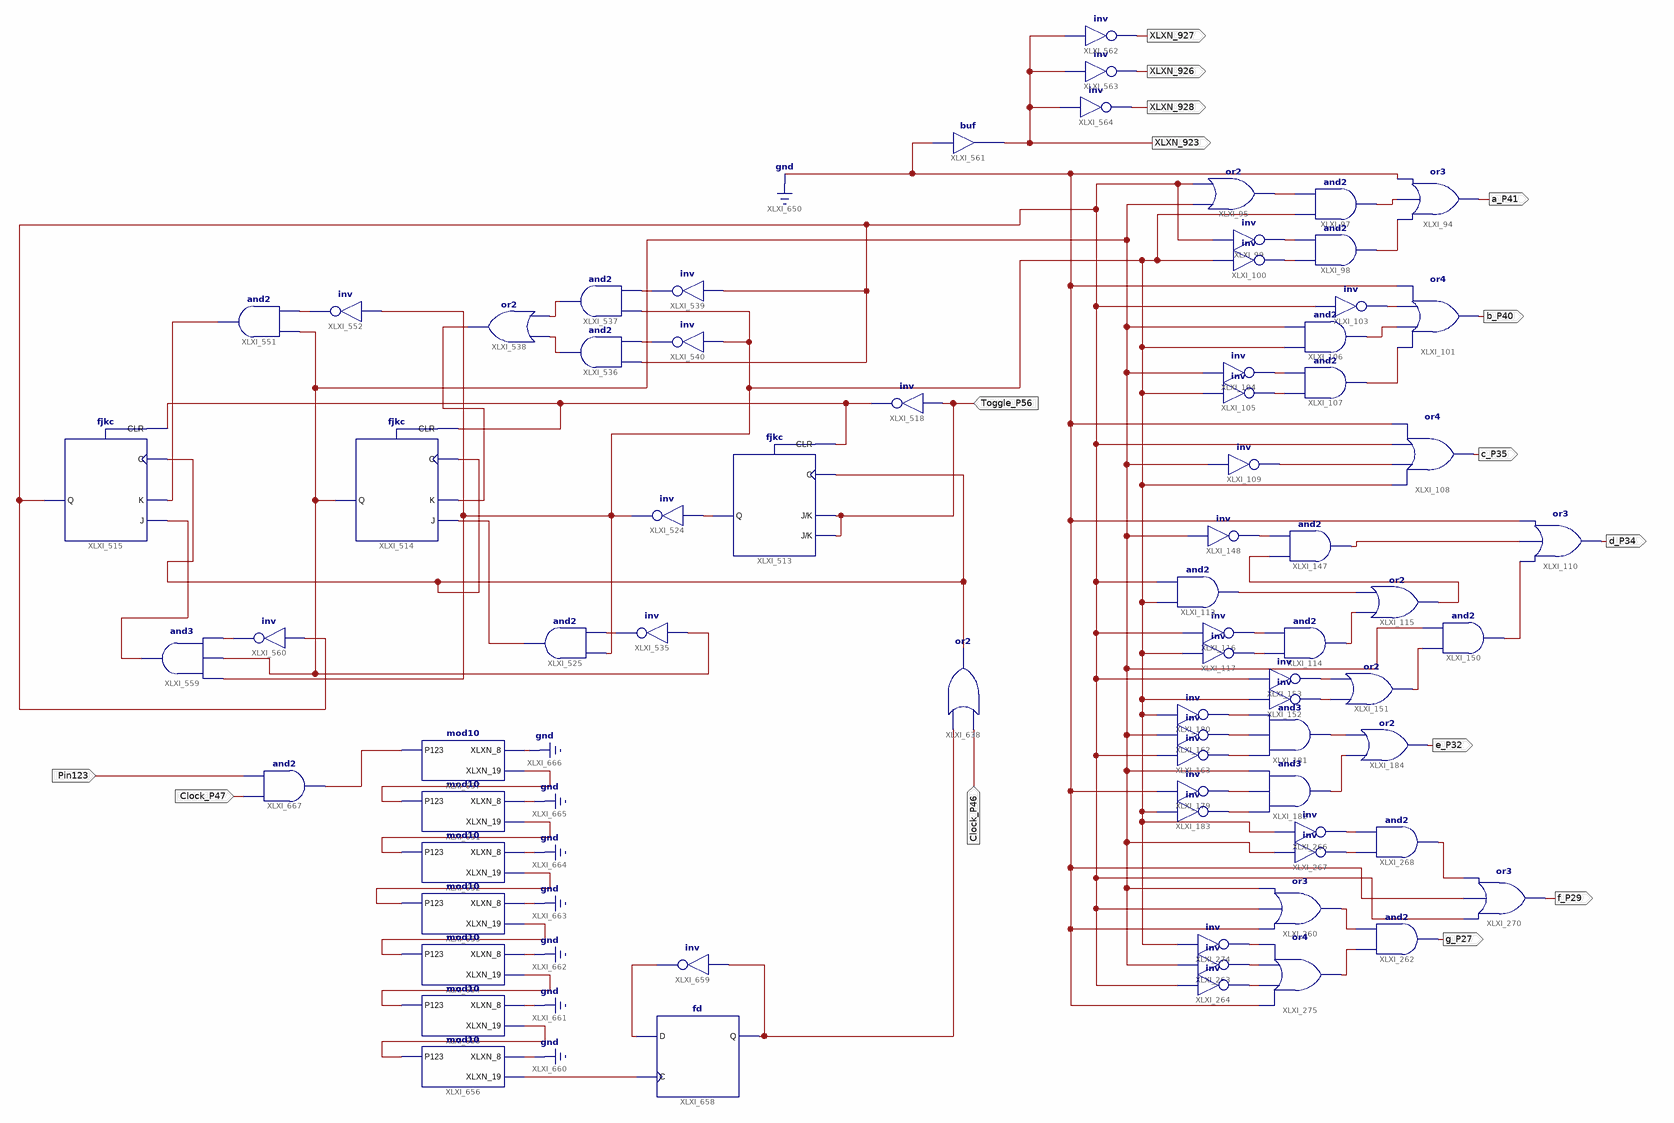
[diagram p0: schematic sheet 1]
// Xilinx ISE schematic Lab05_no2.sch (spartan6) as structural Verilog: 75 symbols, 15 ports
module Lab05_no2 (
  input  Toggle_P56,
  input  Clock_P46,
  input  Clock_P47,
  input  Pin123,
  output a_P41,
  output b_P40,
  output c_P35,
  output e_P32,
  output d_P34,
  output g_P27,
  output f_P29,
  output XLXN_923,
  output XLXN_926,
  output XLXN_927,
  output XLXN_928
);

  wire A_P58, B_P57, C_P56, XLXN_234, XLXN_238, XLXN_241, XLXN_242, XLXN_243, XLXN_249, XLXN_250, XLXN_251,
       XLXN_253, XLXN_254, XLXN_263, XLXN_277, XLXN_278, XLXN_279, XLXN_293, XLXN_320, XLXN_322, XLXN_323,
       XLXN_328, XLXN_329, XLXN_330, XLXN_333, XLXN_380, XLXN_381, XLXN_382, XLXN_383, XLXN_384, XLXN_386,
       XLXN_387, XLXN_513, XLXN_514, XLXN_519, XLXN_520, XLXN_532, XLXN_533, XLXN_536, XLXN_545, XLXN_879,
       XLXN_888, XLXN_891, XLXN_892, XLXN_893, XLXN_895, XLXN_896, XLXN_907, XLXN_910, XLXN_912, XLXN_920,
       XLXN_921, XLXN_1032, XLXN_1034, XLXN_1035, XLXN_1036, XLXN_1038, XLXN_1039, XLXN_1040, XLXN_1041,
       XLXN_1042, XLXN_1060, XLXN_1061, XLXN_1063;

  or XLXI_94 (a_P41, XLXN_241, XLXN_234, 1'b0);
  or XLXI_95 (XLXN_238, B_P57, C_P56);
  and XLXI_97 (XLXN_234, A_P58, XLXN_238);
  and XLXI_98 (XLXN_241, XLXN_243, XLXN_242);
  not XLXI_99 (XLXN_242, C_P56);
  not XLXI_100 (XLXN_243, A_P58);
  or XLXI_101 (b_P40, XLXN_251, XLXN_250, XLXN_249, 1'b0);
  not XLXI_103 (XLXN_249, C_P56);
  and XLXI_106 (XLXN_250, A_P58, B_P57);
  and XLXI_107 (XLXN_251, XLXN_253, XLXN_254);
  not XLXI_105 (XLXN_253, A_P58);
  not XLXI_104 (XLXN_254, B_P57);
  not XLXI_109 (XLXN_263, B_P57);
  or XLXI_108 (c_P35, A_P58, XLXN_263, C_P56, 1'b0);
  or XLXI_115 (XLXN_322, XLXN_293, XLXN_277);
  not XLXI_116 (XLXN_278, C_P56);
  and XLXI_114 (XLXN_293, XLXN_279, XLXN_278);
  and XLXI_113 (XLXN_277, A_P58, C_P56);
  and XLXI_147 (XLXN_323, XLXN_322, XLXN_320);
  not XLXI_148 (XLXN_320, B_P57);
  or XLXI_110 (d_P34, XLXN_333, XLXN_323, 1'b0);
  and XLXI_150 (XLXN_333, XLXN_330, B_P57);
  or XLXI_151 (XLXN_330, XLXN_328, XLXN_329);
  not XLXI_117 (XLXN_279, A_P58);
  not XLXI_153 (XLXN_329, C_P56);
  not XLXI_152 (XLXN_328, A_P58);
  not XLXI_180 (XLXN_382, A_P58);
  not XLXI_162 (XLXN_381, B_P57);
  not XLXI_163 (XLXN_380, C_P56);
  and XLXI_181 (XLXN_386, XLXN_380, XLXN_381, XLXN_382);
  or XLXI_184 (e_P32, XLXN_387, XLXN_386);
  not XLXI_183 (XLXN_384, A_P58);
  not XLXI_179 (XLXN_383, 1'b0);
  or XLXI_260 (XLXN_513, 1'b0, C_P56, B_P57);
  and XLXI_262 (g_P27, XLXN_514, XLXN_513);
  not XLXI_263 (XLXN_519, B_P57);
  not XLXI_264 (XLXN_520, C_P56);
  and XLXI_268 (XLXN_536, XLXN_532, XLXN_533);
  and XLXI_182 (XLXN_387, XLXN_384, XLXN_383, B_P57);
  not XLXI_267 (XLXN_532, B_P57);
  not XLXI_266 (XLXN_533, A_P58);
  or XLXI_270 (f_P29, C_P56, 1'b0, XLXN_536);
  not XLXI_274 (XLXN_545, A_P58);
  or XLXI_275 (XLXN_514, 1'b0, XLXN_520, XLXN_519, XLXN_545);
  not XLXI_518 (XLXN_1032, Toggle_P56);
  fjkc XLXI_513 (.C(XLXN_1060), .CLR(XLXN_1032), .J(Toggle_P56), .K(Toggle_P56), .Q(XLXN_879));
  not XLXI_524 (A_P58, XLXN_879);
  and XLXI_525 (XLXN_891, XLXN_888, A_P58);
  fjkc XLXI_514 (.C(XLXN_1060), .CLR(XLXN_1032), .J(XLXN_891), .K(XLXN_907), .Q(B_P57));
  fjkc XLXI_515 (.C(XLXN_1060), .CLR(XLXN_1032), .J(XLXN_920), .K(XLXN_912), .Q(C_P56));
  not XLXI_535 (XLXN_888, B_P57);
  or XLXI_538 (XLXN_907, XLXN_893, XLXN_892);
  and XLXI_536 (XLXN_892, XLXN_896, C_P56);
  and XLXI_537 (XLXN_893, XLXN_895, A_P58);
  not XLXI_539 (XLXN_895, C_P56);
  not XLXI_540 (XLXN_896, A_P58);
  not XLXI_552 (XLXN_910, A_P58);
  and XLXI_551 (XLXN_912, XLXN_910, B_P57);
  and XLXI_559 (XLXN_920, XLXN_921, B_P57, A_P58);
  not XLXI_560 (XLXN_921, C_P56);
  buf XLXI_561 (XLXN_923, 1'b0);
  not XLXI_562 (XLXN_927, XLXN_923);
  not XLXI_563 (XLXN_926, XLXN_923);
  not XLXI_564 (XLXN_928, XLXN_923);
  or XLXI_638 (XLXN_1060, Clock_P46, XLXN_1061);
  mod10 XLXI_651 (.P123(XLXN_1034), .XLXN_8(1'b0), .XLXN_19(XLXN_1035));
  mod10 XLXI_652 (.P123(XLXN_1035), .XLXN_8(1'b0), .XLXN_19(XLXN_1036));
  mod10 XLXI_653 (.P123(XLXN_1036), .XLXN_8(1'b0), .XLXN_19(XLXN_1038));
  mod10 XLXI_654 (.P123(XLXN_1038), .XLXN_8(1'b0), .XLXN_19(XLXN_1039));
  mod10 XLXI_655 (.P123(XLXN_1039), .XLXN_8(1'b0), .XLXN_19(XLXN_1040));
  mod10 XLXI_656 (.P123(XLXN_1040), .XLXN_8(1'b0), .XLXN_19(XLXN_1041));
  mod10 XLXI_657 (.P123(XLXN_1063), .XLXN_8(1'b0), .XLXN_19(XLXN_1034));
  fd XLXI_658 (.C(XLXN_1041), .D(XLXN_1042), .Q(XLXN_1061));
  not XLXI_659 (XLXN_1042, XLXN_1061);
  and XLXI_667 (XLXN_1063, Clock_P47, Pin123);
endmodule
